# EAGLE design GBM-Single (EAGLE 5.10)
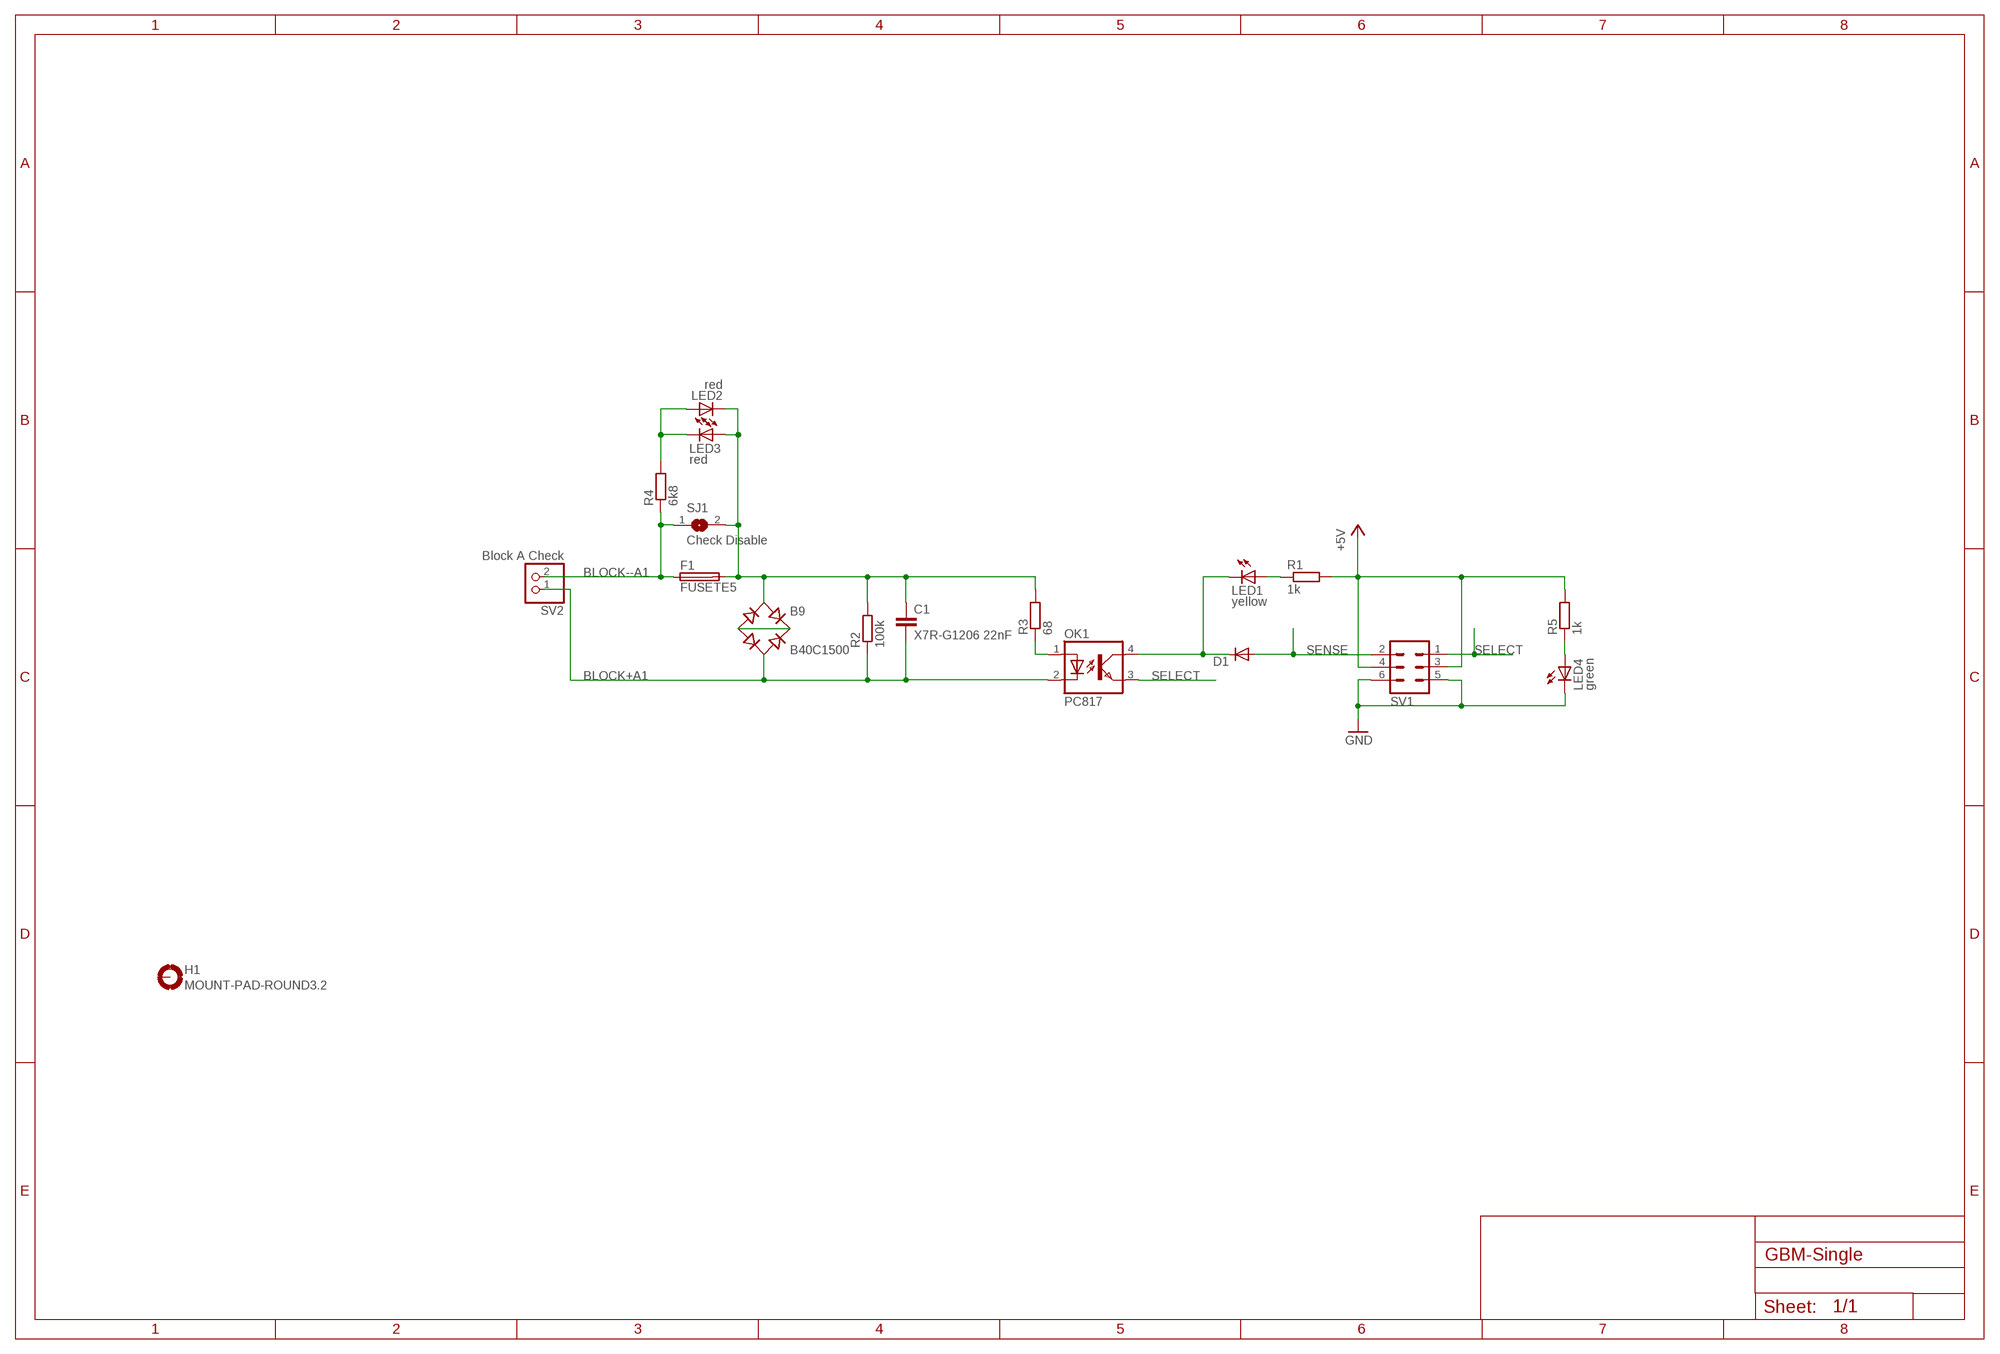
[diagram p0: schematic, sheet 1]

## Parts
B9  B40C1500  RB1A  [RB1A]
C1  X7R-G1206 22nF  C-EUC0805  [C0805]
D1  DIODE-MINIMELF  [MINIMELF]
F1  FUSETE5  [TE5]
H1  MOUNT-PAD-ROUND3.2  [3,2-PAD]
LED1  yellow  LED3MM  [LED3MM]
LED2  red  LED3MM  [LED3MM]
LED3  red  LED3MM  [LED3MM]
LED4  green  LED3MM  [LED3MM]
OK1  PC817  [DIL04]
R1  1k  R-EU_R0805  [R0805]
R2  100k  R-EU_R0805  [R0805]
R3  68  R-EU_R0805  [R0805]
R4  6k8  R-EU_R0805  [R0805]
R5  1k  R-EU_R0805  [R0805]
SJ1  Check Disable  SJ  [SJ]
SV1  ML6  [ML6]
SV2  Block A Check  PINHD-1X2  [1X02]

## Nets
+5V: R1.2 R5.2 SV1.3 SV1.4
BLOCK+A1: B9.AC2 C1.2 OK1.2(C) R2.1 SV2.1
BLOCK--A1: F1.1 R4.1 SJ1.1 SV2.2
BLOCK-A1: B9.AC1 C1.1 F1.2 LED2.K(C) LED3.A R2.2 R3.2 SJ1.2
GND: LED4.K(C) SV1.5 SV1.6
N$1: OK1.1(A) R3.1
N$3: LED4.A R5.1
N$4: LED1.A R1.1
N$7: D1.C LED1.K(C) OK1.4(COL)
N$15: LED2.A LED3.K(C) R4.2
N$44: B9.+ B9.-
SELECT: OK1.3(EMIT) SV1.1
SENSE: D1.A SV1.2
Unconnected: H1.B3,2(MOUNT)

## Library data of the parts
B9 = rectifier:RB1A: RECTIFIER 1 A
C1 = rcl:C-EU: CAPACITOR, European symbol
D1 = diode:DIODE-: DIODE
F1 = fuse:FUSE: Fuse
H1 = holes:MOUNT-PAD-ROUND: MOUNTING PAD, round
LED1-LED4 = led:LED: LED OSRAM: - CHIPLED LG R971, LG N971, LY N971, LG Q971, LY Q971, LO R971, LY R971 LH N974, LH R974 LS Q976, LO Q976, LY Q976 LO Q996 - Hyper CHIPLED LW Q18S LB Q993, LB Q99A, LB R99A - SideLED LS A670, LO A670, LY A670, LG A670, LP A670 LB A673, LV A673, LT A673, LW A673 LH A674 LY A675 LS A676, LA A676, LO A676, LY A676, LW A676 LS A679, LY A679, LG A679 - Hyper Micro SIDELED® LS Y876, LA Y876, LO Y876, LY Y876 LT Y87S - SmartLED LW L88C, LW L88S LB L89C, LB L89S, LG L890 LS L89K, LO L89K, LY L89K LS L896, LA L896, LO L896, LY L896 - TOPLED LS T670, LO T670, LY T670, LG T670, LP T670 LSG T670, LSP T670, LSY T670, LOP T670, LYG T670 LG T671, LOG T671, LSG T671 LB T673, LV T673, LT T673, LW T673 LH T674 LS T676, LA T676, LO T676, LY T676, LB T676, LH T676, LSB T676, LW T676 LB T67C, LV T67C, LT T67C, LS T67K, LO T67K, LY T67K, LW E67C LS E67B, LA E67B, LO E67B, LY E67B, LB E67C, LV E67C, LT E67C LW T67C LS T679, LY T679, LG T679 LS T770, LO T770, LY T770, LG T770, LP T770 LB T773, LV T773, LT T773, LW T773 LH T774 LS E675, LA E675, LY E675, LS T675 LS T776, LA T776, LO T776, LY T776, LB T776 LHGB T686 LT T68C, LB T68C - Hyper Mini TOPLED® LB M676 - Mini TOPLED Santana® LG M470 LS M47K, LO M47K, LY M47K Source: http://www.osram.convergy.de LUXEON: - LUMILED® LXK2-PW12-R00, LXK2-PW12-S00, LXK2-PW14-U00, LXK2-PW14-V00 LXK2-PM12-R00, LXK2-PM12-S00, LXK2-PM14-U00 LXK2-PE12-Q00, LXK2-PE12-R00, LXK2-PE12-S00, LXK2-PE14-T00, LXK2-PE14-U00 LXK2-PB12-K00, LXK2-PB12-L00, LXK2-PB12-M00, LXK2-PB14-N00, LXK2-PB14-P00, LXK2-PB14-Q00 LXK2-PR12-L00, LXK2-PR12-M00, LXK2-PR14-Q00, LXK2-PR14-R00 LXK2-PD12-Q00, LXK2-PD12-R00, LXK2-PD12-S00 LXK2-PH12-R00, LXK2-PH12-S00 LXK2-PL12-P00, LXK2-PL12-Q00, LXK2-PL12-R00 Source: www.luxeon.com KINGBRIGHT: KA-3528ASYC Source: www.kingbright.com
OK1 = optocoupler:PC817: SHARP OPTO COUPLER
R1-R5 = rcl:R-EU_: RESISTOR, European symbol
SJ1 = jumper:SJ: SMD solder JUMPER
SV1 = con-harting-ml:ML6: HARTING
SV2 = pinhead:PINHD-1X2: PIN HEADER

## Board
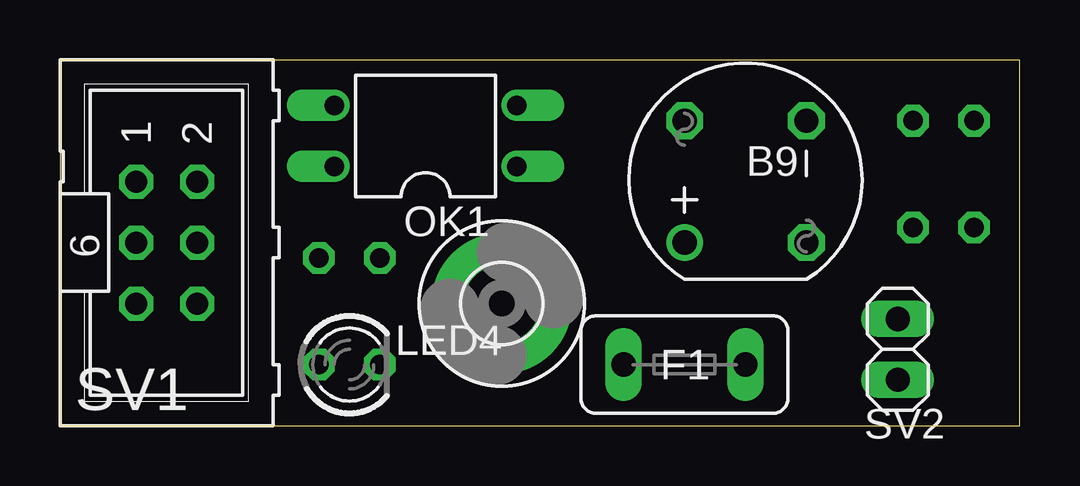
[diagram p1: board, top side]
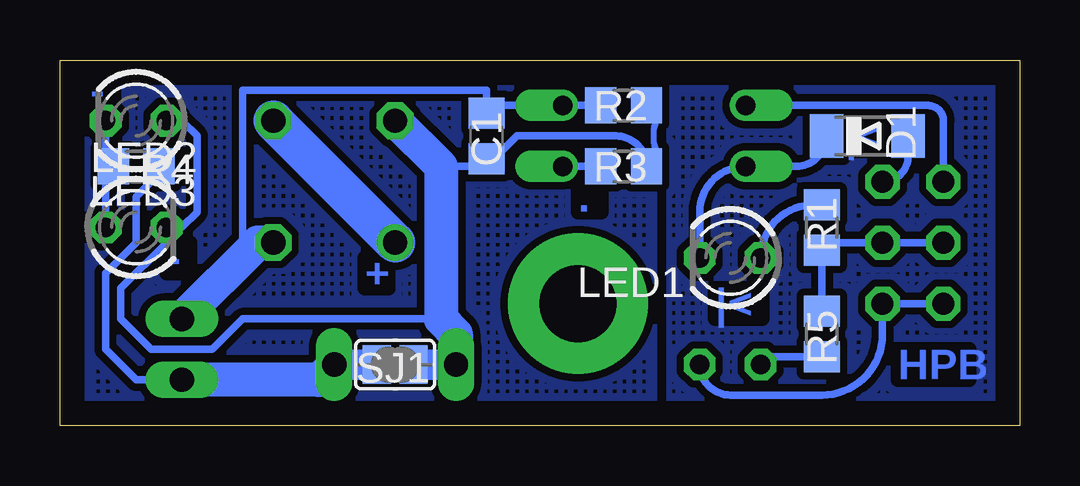
[diagram p2: board, bottom side, seen from below]

Size 40.01 x 15.23 mm. Coordinates in mm from the lower left corner, seen from the top.
Outline: 0,0 40.01,0 40.01,15.23 0,15.23 0,0
Copper layers (1*16): Top 0.035mm / dielectric 1.5mm / Bottom 0.035mm
Design rules "default": minimum track width 10mil, minimum drill 24mil, track to track 8mil, track to pad 8mil, pad to pad 8mil, via to via 8mil, smd to smd 8mil, copper to edge 40mil, drill to drill 8mil, minimum pad ring 10mil, minimum via ring 8mil, stop-mask expansion 4mil, vias tented up to drill 0mil, thermal gap 10mil

### Footprints (pad centres in the part's own frame; a part is rotated, then mirrored left to right if it is on the bottom)
RB1A = drill 1.016 round: + -2.54,2.54 | drill 1.016 octagon: - 2.54,-2.54; AC1 2.54,2.54; AC2 -2.54,-2.54
C0805 = smd 1.3 x 1.5: 1 -0.95,0; 2 0.95,0
MINIMELF = smd 1.4 x 1.8: A 1.7,0; C -1.7,0
TE5 = drill 1.016 long: 1 -2.54,0; 2 2.54,0
3,2-PAD = drill 3.2 pad 5.842 round: B3,2 0,0
LED3MM = drill 0.813 octagon: A -1.27,0; K 1.27,0
DIL04 = drill 0.813 offset: 1 -1.27,-3.81; 2 1.27,-3.81; 3 1.27,3.81; 4 -1.27,3.81
R0805 = smd 1.3 x 1.5: 1 -0.95,0; 2 0.95,0
SJ = smd 1.168 x 1.6: 1 -0.762,0; 2 0.762,0
ML6 = drill 0.914 octagon: 1 -2.54,-1.27; 2 -2.54,1.27; 3 0,-1.27; 4 0,1.27; 5 2.54,-1.27; 6 2.54,1.27
1X02 = drill 1.016 long: 1 -1.27,0; 2 1.27,0

### Placement (x,y rotation side)
B9  28.57,10.16 90 top
C1  22.23,12.06 90 bottom
D1  6.35,12.06 0 bottom
F1  26.04,2.54 180 top
H1  18.41,5.08 0 top
LED1  12.06,6.99 180 bottom
LED2  36.83,8.26 0 bottom
LED3  36.83,12.7 180 bottom
LED4  12.06,2.54 0 top
OK1  15.24,12.06 90 top
R1  8.26,8.26 270 bottom
R2  16.51,13.34 0 bottom
R3  16.51,10.79 0 bottom
R4  36.83,10.79 180 bottom
R5  8.26,3.81 90 bottom
SJ1  26.04,2.54 0 bottom
SV1  4.45,7.62 270 top
SV2  34.92,3.17 270 top

### Tracks (layer width: path | path; a pad name or v marks a point on that pad's centre or on a via)
+5V
  Bottom 0.305: SV1.3 SV1.4 8.26,7.62 R1.2 R5.2
BLOCK+A1
  Bottom 0.305: C1.2 21.91,13.34 | R2.1 OK1.2 22.23,13.34 C1.2 | C1.2 22.23,13.97 32.38,13.97 32.38,7.62 B9.AC2
  Bottom 1.422: B9.AC2 31.75,7.62 SV2.1
BLOCK--A1
  Bottom 0.305: SV2.2 36.83,1.91 38.1,3.17 38.1,6.35 36.83,7.62 36.83,9.53 36.2,10.16 36.2,10.48 R4.1
  Bottom 1.27: SJ1.1 F1.1
  Bottom 1.422: SV2.2 29.21,1.91 F1.1
BLOCK-A1
  Bottom 0.254: R3.2 arc-90 15.24,11.75 15.24,12.38 arc-90 R2.2
  Bottom 0.305: R3.2 arc-90 16.83,12.06 20.95,12.06 21.91,11.12 C1.1 22.23,10.79 24.13,10.79 | 24.13,4.45 32.38,4.45 33.66,3.17 36.2,3.17 37.47,4.45 37.47,5.71 35.56,7.62 LED2.K 34.92,8.26 34.29,8.89 34.29,12.06 34.92,12.7 LED3.A
  Bottom 1.27: F1.2 SJ1.2
  Bottom 1.422: B9.AC1 24.13,10.79 24.13,4.45 23.5,3.81 F1.2
GND
  Bottom 0.305: LED4.K arc-90 12.06,1.27 8.26,1.27 arc-90 5.71,3.81 SV1.6 SV1.5
N$1
  Bottom 0.305: R3.1 OK1.1
N$2
  pour Bottom (isolate 0.305, rank 2, no thermals, hatched): 15.24,0 40.01,0 40.01,15.24 15.24,15.24
  pour Bottom (isolate 0.305, rank 2, no thermals, hatched): 0,0 14.61,0 14.61,15.24 0,15.24
N$3
  Bottom 0.305: LED4.A arc90 10.47,2.86 R5.1
N$4
  Bottom 0.305: LED1.A arc90 8.57,9.21 R1.1
N$7
  Bottom 0.305: D1.C arc90 9.32,10.79 OK1.4 arc-90 13.34,8.89 LED1.K
N$15
  Bottom 0.305: LED2.A 38.1,10.47 R4.2 38.1,11.12 LED3.K
N$44
  Bottom 1.676: B9.+ B9.-
SELECT
  Bottom 0.305: OK1.3 3.81,13.34 arc90 3.17,12.7 SV1.1
SENSE
  Bottom 0.305: SV1.2 arc-90 4.65,11.22 D1.A

### Text on the board
Bottom: |< | - | . | + | - | |< | HPB